# EAGLE design uv-dosimeter-guva-op-amp-mk-1.2 (EAGLE 7.5.0)
AUTHOR: sean@yak.net
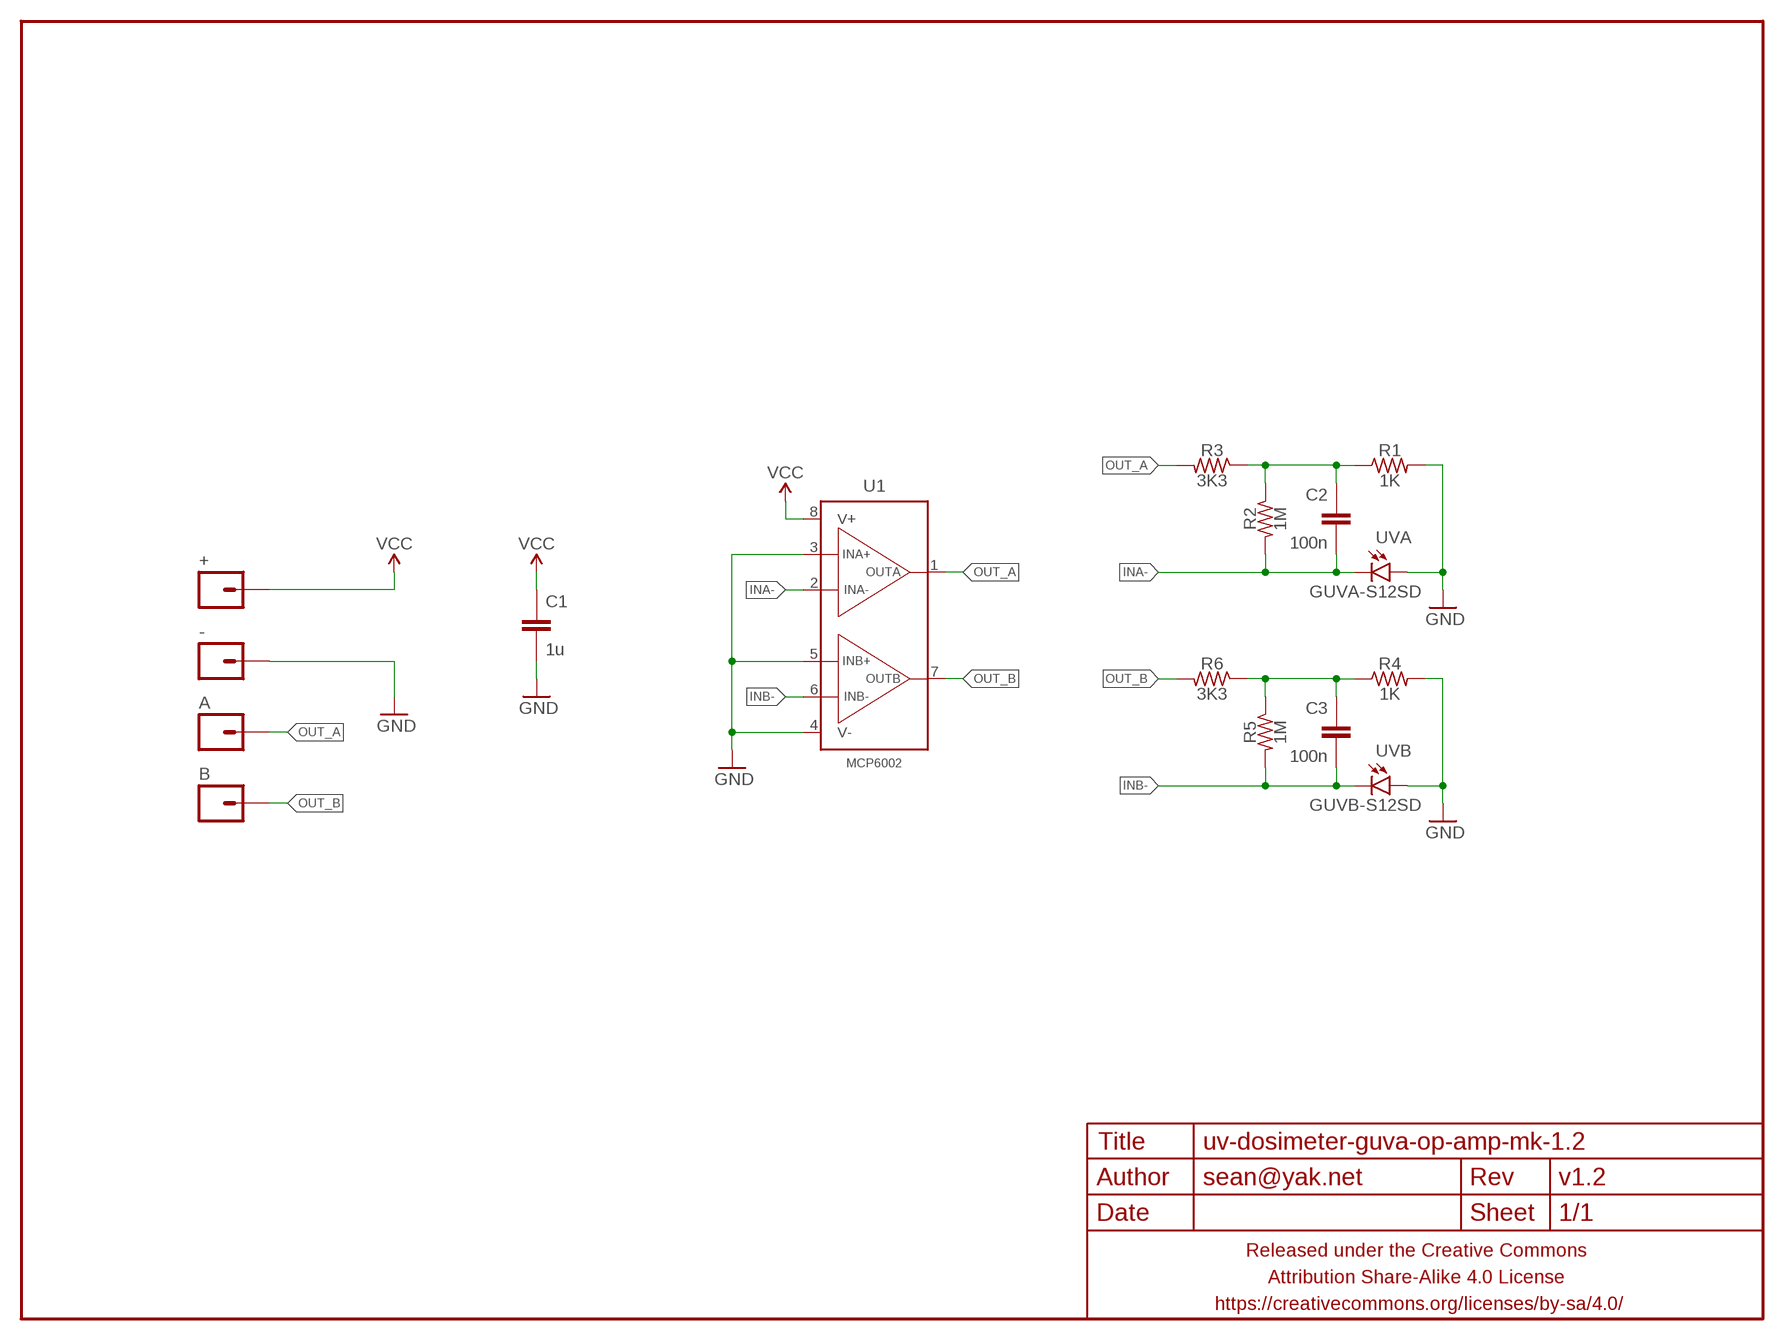
[diagram p0: schematic, sheet 1]

## Parts
+  M01PTH  [1X01]
-  M01PTH  [1X01]
A  M01PTH  [1X01]
B  M01PTH  [1X01]
C1  1u  CAPACITOR-CERAMICC0603  [C0603]
C2  100n  CAPACITOR-CERAMICC0603  [C0603]
C3  100n  CAPACITOR-CERAMICC0603  [C0603]
FRAME1  FRAME-LETTERNO_PACKAGE  [DUMMY]
R1  1K  RESISTORR0603  [R0603]
R2  1M  RESISTORR0603  [R0603]
R3  3K3  RESISTORR0603  [R0603]
R4  1K  RESISTORR0603  [R0603]
R5  1M  RESISTORR0603  [R0603]
R6  3K3  RESISTORR0603  [R0603]
U1  MCP6002  MCP6002SOIC  [SO08]
UVA  GUVA-S12SD  GUVA-S12SDLED3528  [LED3528]
UVB  GUVB-S12SD  GUVA-S12SDLED3528  [LED3528]

## Nets
GND: -.1 C1.2 R1.2 R4.2 U1.3(INA+) U1.4(V-) U1.5(INB+) UVA.A UVB.A
INA-: C2.2 R2.2 U1.2(INA-) UVA.K(C)
INB-: C3.2 R5.2 U1.6(INB-) UVB.K(C)
N$2: C2.1 R1.1 R2.1 R3.1
N$4: C3.1 R4.1 R5.1 R6.1
OUT_A: A.1 R3.2 U1.1(OUTA)
OUT_B: B.1 R6.2 U1.7(OUTB)
VCC: +.1 C1.1 U1.8(V+)

## Library data of the parts
+ - A B = a_parts:M01: Header 1 Standard 1-pin 0.1" header. Use with straight break away headers (SKU : PRT-00116), right angle break away headers (PRT-00553), swiss pins (PRT-00743), machine pins (PRT-00117), and female headers (PRT-00115).
C1-C3 = a_parts:CAPACITOR-CERAMIC: CAPACITOR, European symbol
FRAME1 = A_butts:FRAME-LETTER: Schematic Frame Standard 8.5x11 US Letter frame; DESIGNER: sean@yak.net; VERSION: v1.2
R1-R6 = a_parts:RESISTOR: RESISTOR, American symbol
U1 = a_parts:MCP6002
UVA UVB = a_parts:GUVA-S12SD

## Board
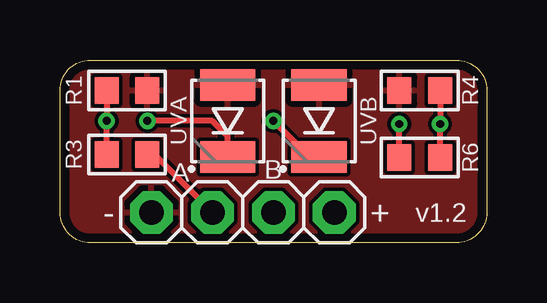
[diagram p1: board, top side]
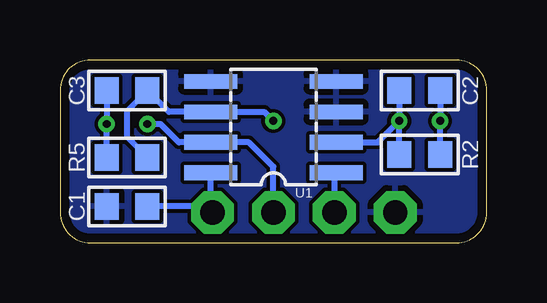
[diagram p2: board, bottom side, seen from below]

Size 17.78 x 7.62 mm. Coordinates in mm from the lower left corner, seen from the top.
Outline: 16.51,0 1.27,0 arc-90 0,1.27 0,6.35 arc-90 1.27,7.62 16.51,7.62 arc-90 17.78,6.35 17.78,1.27 arc-90 16.51,0
Copper layers (1*16): Top 0.0356mm / dielectric 1.5011mm / Bottom 0.0356mm
Design rules "LaenPCBOrder_2": minimum track width 6mil, minimum drill 13mil, track to track 6mil, track to pad 6mil, pad to pad 6mil, via to via 6mil, smd to smd 6mil, copper to edge 15mil, drill to drill 6mil, minimum pad ring 7mil, minimum via ring 7mil, stop-mask expansion 3mil, vias tented up to drill 20mil, thermal gap 10mil

### Footprints (pad centres in the part's own frame; a part is rotated, then mirrored left to right if it is on the bottom)
1X01 = drill 1.016 pad 1.778 octagon: 1 0,0
C0603 = smd 1 x 1.1: 1 -0.85,0; 2 0.85,0
R0603 = smd 1 x 1.1: 1 -0.85,0; 2 0.85,0
SO08 = smd 0.61 x 2.21: 1 -1.905,-2.616; 2 -0.635,-2.616; 3 0.635,-2.616; 4 1.905,-2.616; 5 1.905,2.616; 6 0.635,2.616; 7 -0.635,2.616; 8 -1.905,2.616
LED3528 = smd 2.3 x 1.3: A 0,-1.5; K 0,1.5

### Placement (x,y rotation side)
+  11.43,1.27 0 top
-  3.81,1.27 0 top
A  6.35,1.27 0 top
B  8.89,1.27 0 top
C1  14.99,1.52 180 bottom
C2  2.79,6.35 180 bottom
C3  14.99,6.35 0 bottom
FRAME1  0,0 90 bottom
R1  2.79,6.35 0 top
R2  2.79,3.68 180 bottom
R3  2.79,3.68 0 top
R4  14.99,6.35 180 top
R5  14.99,3.56 0 bottom
R6  14.99,3.56 180 top
U1  8.89,4.83 90 bottom
UVA  6.99,5.08 180 top
UVB  10.79,5.08 180 top

### Tracks (layer width: path | path; a pad name or v marks a point on that pad's centre or on a via)
GND
  pour Bottom (rank 6): 16.51,0 1.27,0 arc-90 0,1.27 0,6.35 arc-90 1.27,7.62 16.51,7.62 arc-90 17.78,6.35 17.78,1.27 arc-90
  pour Top: 16.51,0 1.27,0 arc-90 0,1.27 0,6.35 arc-90 1.27,7.62 16.51,7.62 arc-90 17.78,6.35 17.78,1.27 arc-90
INA-  (via drill 0.33)
  Top 0.254: UVA.K 6.99,4.45 6.35,5.08 v3.64,5.08
  Bottom 0.254: R2.2 v3.64,5.08 | C2.2 v3.64,5.08 | U1.2 4.53,4.19 v3.64,5.08
INB-  (via drill 0.33)
  Top 0.254: UVB.K 10.39,3.58 v8.89,5.08
  Bottom 0.254: R5.2 14.99,4.41 14.99,5.5 C3.2 13.25,5.46 U1.6 9.27,5.46 v8.89,5.08
N$2  (via drill 0.33)
  Top 0.254: R1.1 v1.94,5.08 R2.1
  Bottom 0.254: R2.1 v1.94,5.08 R1.1
N$4  (via drill 0.33)
  Top 0.254: R4.1 v15.84,4.95 R5.1
  Bottom 0.254: R4.1 v15.84,4.95 R5.1
OUT_A
  Top 0.254: R3.2 3.94,3.68 A.1
  Bottom 0.254: U1.1 6.35,2.85 A.1
OUT_B  (via drill 0.33)
  Top 0.254: R6.2 v14.14,4.95
  Bottom 0.254: B.1 8.89,3.17 9.91,4.19 U1.7 12.83,4.19 13.59,4.95 v14.14,4.95
VCC
  Bottom 0.254: +.1 11.51,1.35 | 11.51,1.35 U1.8 | 11.51,1.35 11.68,1.52 C1.1